# Altium project LLY.PrjPcb
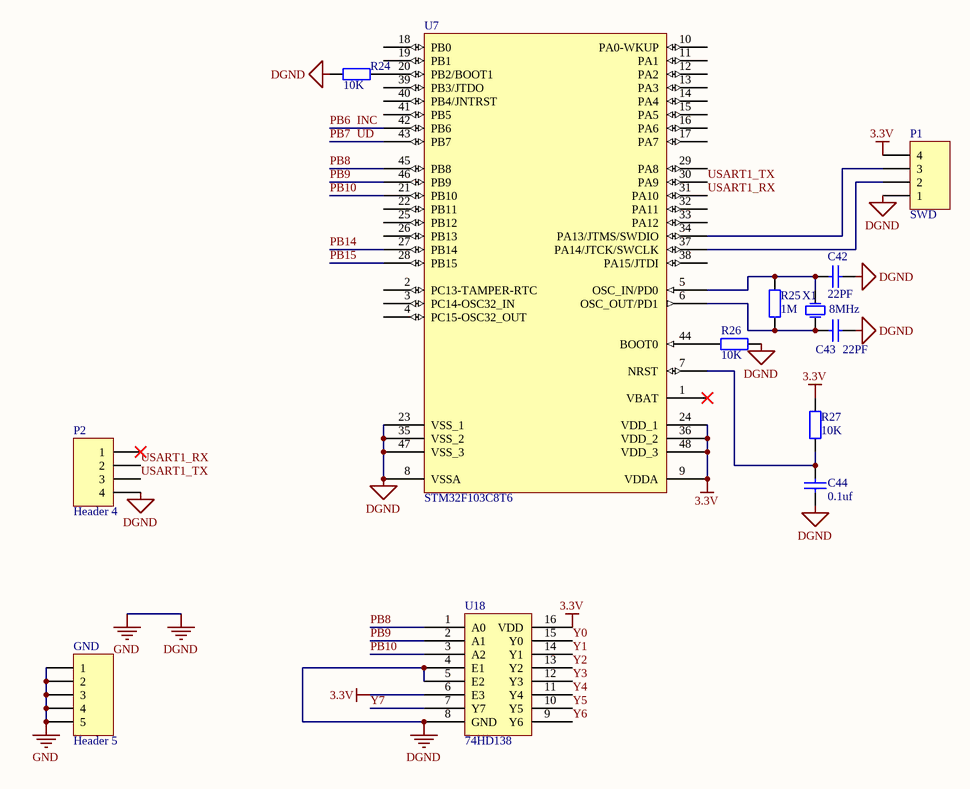
[diagram p0: LLY.SchDoc]
8 sheets, 280 parts. Net scope: global (net labels, ports and power ports of the same name join across sheets).
Board file: LLY.PcbDoc
Sheets:
  LLY.SchDoc
  POWER.SchDoc
  Audio_in.SchDoc
  Audio_out.SchDoc
  channel12.SchDoc
  channel78.SchDoc
  channel34.SchDoc
  channel56.SchDoc

## Sheet LLY.SchDoc
size A4

### Parts
C42  22PF  [0805C]
C43  22PF  [0805C]
C44  0.1uf  [0805C]
GND  Header 5  [HDR1X5]
P1  SWD  [HDR1X4]
P2  Header 4  [XH2.54W-4P]
R24  10K  [0805R]
R25  1M  [0805R]
R26  10K  [0805R]
R27  10K  [0805R]
U7  STM32F103C8T6  [LQFP48_L]
U18  74HD138  [SOP16]
X1  8MHz  [XTAL_US]

### Nets
3.3V: P1.4 R27.2 U7.9(VDDA) U7.24(VDD_1) U7.36(VDD_2) U7.48(VDD_3) U18.6(E3) U18.16(VDD)
DGND: C42.1 C43.1 C44.2 GND.1 GND.2 GND.3 GND.4 GND.5 P1.1 P2.4 R24.1 R26.2 U7.8(VSSA) U7.23(VSS_1) U7.35(VSS_2) U7.47(VSS_3) U18.4(E1) U18.5(E2) U18.8(GND)  [also labelled GND]
INC: U7.42(PB6)  [also labelled PB6]
PB7: U7.43(PB7)  [also labelled UD]
PB8: U7.45(PB8) U18.1(A0)
PB9: U7.46(PB9) U18.2(A1)
PB10: U7.21(PB10) U18.3(A2)
PB14: U7.27(PB14)
PB15: U7.28(PB15)
USART1_RX: P2.2 U7.31(PA10)
USART1_TX: P2.3 U7.30(PA9)
Y0: U18.15(Y0)
Y1: U18.14(Y1)
Y2: U18.13(Y2)
Y3: U18.12(Y3)
Y4: U18.11(Y4)
Y5: U18.10(Y5)
Y6: U18.9(Y6)
Y7: U18.7(Y7)
NetC42_2: C42.2 R25.1 U7.5(OSC_IN/PD0) X1.2(OSC2)
NetC43_2: C43.2 R25.2 U7.6(OSC_OUT/PD1) X1.1(OSC1)
NetC44_1: C44.1 R27.1 U7.7(NRST)
NetP1_2: P1.2 U7.37(PA14/JTCK/SWCLK)
NetP1_3: P1.3 U7.34(PA13/JTMS/SWDIO)
NetR24_2: R24.2 U7.20(PB2/BOOT1)
NetR26_1: R26.1 U7.44(BOOT0)

Not connected (* = marked no-connect by the designer): P2 1*; U7 1(VBAT)* 2(PC13-TAMPER-RTC) 3(PC14-OSC32_IN) 4(PC15-OSC32_OUT) 10(PA0-WKUP) 11(PA1) 12(PA2) 13(PA3) 14(PA4) 15(PA5) 16(PA6) 17(PA7) 18(PB0) 19(PB1) 22(PB11) 25(PB12) 26(PB13) 29(PA8) 32(PA11) 33(PA12) 38(PA15/JTDI) 39(PB3/JTDO) 40(PB4/JNTRST) 41(PB5)

### Library data of the parts
C42 C43 = Cap: Capacitor; Value: 0.1uF; Published: 8-Jun-2000; LatestRevisionDate: 17-Jul-2002; LatestRevisionNote: Re-released for DXP Platform.; PackageReference: RAD-0.3; Publisher: Altium Limited; PackageDescription: Radial Cap, Thru-Hole; 2 Leads; 0.3 in Pin Spacing
C44 = Cap: Capacitor; Value: 0.01uF; Published: 8-Jun-2000; LatestRevisionDate: 17-Jul-2002; LatestRevisionNote: Re-released for DXP Platform.; PackageReference: RAD-0.3; Publisher: Altium Limited; PackageDescription: Radial Cap, Thru-Hole; 2 Leads; 0.3 in Pin Spacing
GND = Header 5: Header, 5-Pin; LatestRevisionDate: 17-Jul-2002; LatestRevisionNote: Re-released for DXP Platform.; Publisher: Altium Limited
P1 = Header 4: LatestRevisionDate: 17-Jul-2002; LatestRevisionNote: Re-released for DXP Platform.; Publisher: Altium Limited
P2 = Header 4: Header, 4-Pin; LatestRevisionDate: 17-Jul-2002; LatestRevisionNote: Re-released for DXP Platform.; Publisher: Altium Limited
R24-R26 = Res2: Resistor; Published: 8-Jun-2000; LatestRevisionDate: 17-Jul-2002; LatestRevisionNote: Re-released for DXP Platform.; PackageReference: AXIAL-0.4; Publisher: Altium Limited; PackageDescription: Axial Device, Thru-Hole; 2 Leads; 0.4 in Pin Spacing
  R24 R26: Value: 10K
R27 = Res2: Resistor; Value: 1K; Published: 8-Jun-2000; LatestRevisionDate: 17-Jul-2002; LatestRevisionNote: Re-released for DXP Platform.; PackageReference: AXIAL-0.4; Publisher: Altium Limited; PackageDescription: Axial Device, Thru-Hole; 2 Leads; 0.4 in Pin Spacing
U7 = STM32F103CBT6: STM32单片机48脚; Published: 30-May-2008; DatasheetVersion: rev6, Mar-2008; PackageVersion: Mar-2008; PackageReference: LQFP48; Publisher: Altium Limited; PackageDescription: 48-Pin Low-Profile Quad Flat Pack, 7 x 7 mm Body, 0.5 mm Pitch (LQFP48); ComponentLink1Description: Manufacturer Link; ComponentLink1URL: www.st.com/stm32; ComponentLink2Description: Datasheet; ComponentLink2URL: http://www.st.com/stonline/products/literature/ds/13587.pdf
U18 = 74HD138: 74HC138
X1 = XTAL: Crystal Oscillator; Published: 8-Jun-2000; LatestRevisionDate: 17-Jul-2002; LatestRevisionNote: Re-released for DXP Platform.; Publisher: Altium Limited

## Sheet POWER.SchDoc
size A4
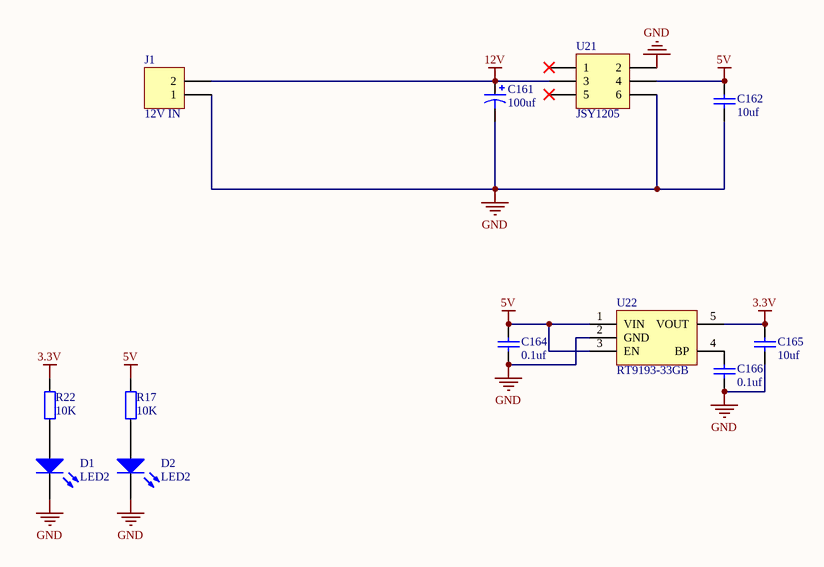
[diagram p1: POWER.SchDoc]

### Parts
C161  100uf  [7343C]
C162  10uf  [0805C]
C164  0.1uf  [0805C]
C165  10uf  [0805C]
C166  0.1uf  [0805C]
D1  LED2  [LED-0805]
D2  LED2  [LED-0805]
J1  12V IN  [VH3.96*2]
R17  10K  [0805R]
R22  10K  [0805R]
U21  JSY1205  [JSY_1205]
U22  RT9193-33GB  [SOT-23-5L]

### Nets
3.3V: C165.2 R22.2 U22.5(VOUT)
5V: C162.2 C164.2 R17.2 U21.4 U22.1(VIN) U22.3(EN)
12V: C161.1 J1.2 U21.3
GND: C161.2 C162.1 C164.1 C165.1 C166.1 D1.2(K) D2.2(K) J1.1 U21.2 U21.6 U22.2(GND)  [project net DGND]
NetC166_2: C166.2 U22.4(BP)
NetD1_1: D1.1(A) R22.1
NetD2_1: D2.1(A) R17.1

Not connected (* = marked no-connect by the designer): U21 1* 5*

### Library data of the parts
C161 = Cap Pol1: Polarized Capacitor (Radial); Published: 8-Jun-2000; LatestRevisionDate: 17-Jul-2002; LatestRevisionNote: Re-released for DXP Platform.; PackageReference: RB7.6-15; Publisher: Altium Limited; PackageDescription: Polarized Capacitor (Radial); 2 Leads
C162 C165 C166 = Cap: Capacitor; Published: 8-Jun-2000; LatestRevisionDate: 17-Jul-2002; LatestRevisionNote: Re-released for DXP Platform.; PackageReference: RAD-0.3; Publisher: Altium Limited; PackageDescription: Radial Cap, Thru-Hole; 2 Leads; 0.3 in Pin Spacing
C164 = Cap: capacitor; Published: 8-Jun-2000; LatestRevisionDate: 17-Jul-2002; LatestRevisionNote: Re-released for DXP Platform.; PackageReference: RAD-0.3; Publisher: Altium Limited; PackageDescription: Radial Cap, Thru-Hole; 2 Leads; 0.3 in Pin Spacing
D1 D2 = LED2: Typical RED, GREEN, YELLOW, AMBER GaAs LED; Published: 8-Jun-2000; LatestRevisionDate: 17-Jul-2002; LatestRevisionNote: Re-released for DXP Platform.; PackageVersion: Feb-2002; PackageReference: 3.2X1.6X1.1; Publisher: Altium Limited; PackageDescription: SM LED; 2 Flat Leads
J1 = Header 2: Header, 2-Pin; LatestRevisionDate: 17-Jul-2002; LatestRevisionNote: Re-released for DXP Platform.; Publisher: Altium Limited
R17 R22 = Res2: Resistor; Value: 1K; Published: 8-Jun-2000; LatestRevisionDate: 17-Jul-2002; LatestRevisionNote: Re-released for DXP Platform.; PackageReference: AXIAL-0.4; Publisher: Altium Limited; PackageDescription: Axial Device, Thru-Hole; 2 Leads; 0.4 in Pin Spacing
U21 = Header 3X2: Header, 3-Pin, Dual row; LatestRevisionDate: 17-Jul-2002; LatestRevisionNote: Re-released for DXP Platform.; Publisher: Altium Limited
U22 = RT9193: 电源芯片

## Sheet Audio_in.SchDoc
size A4
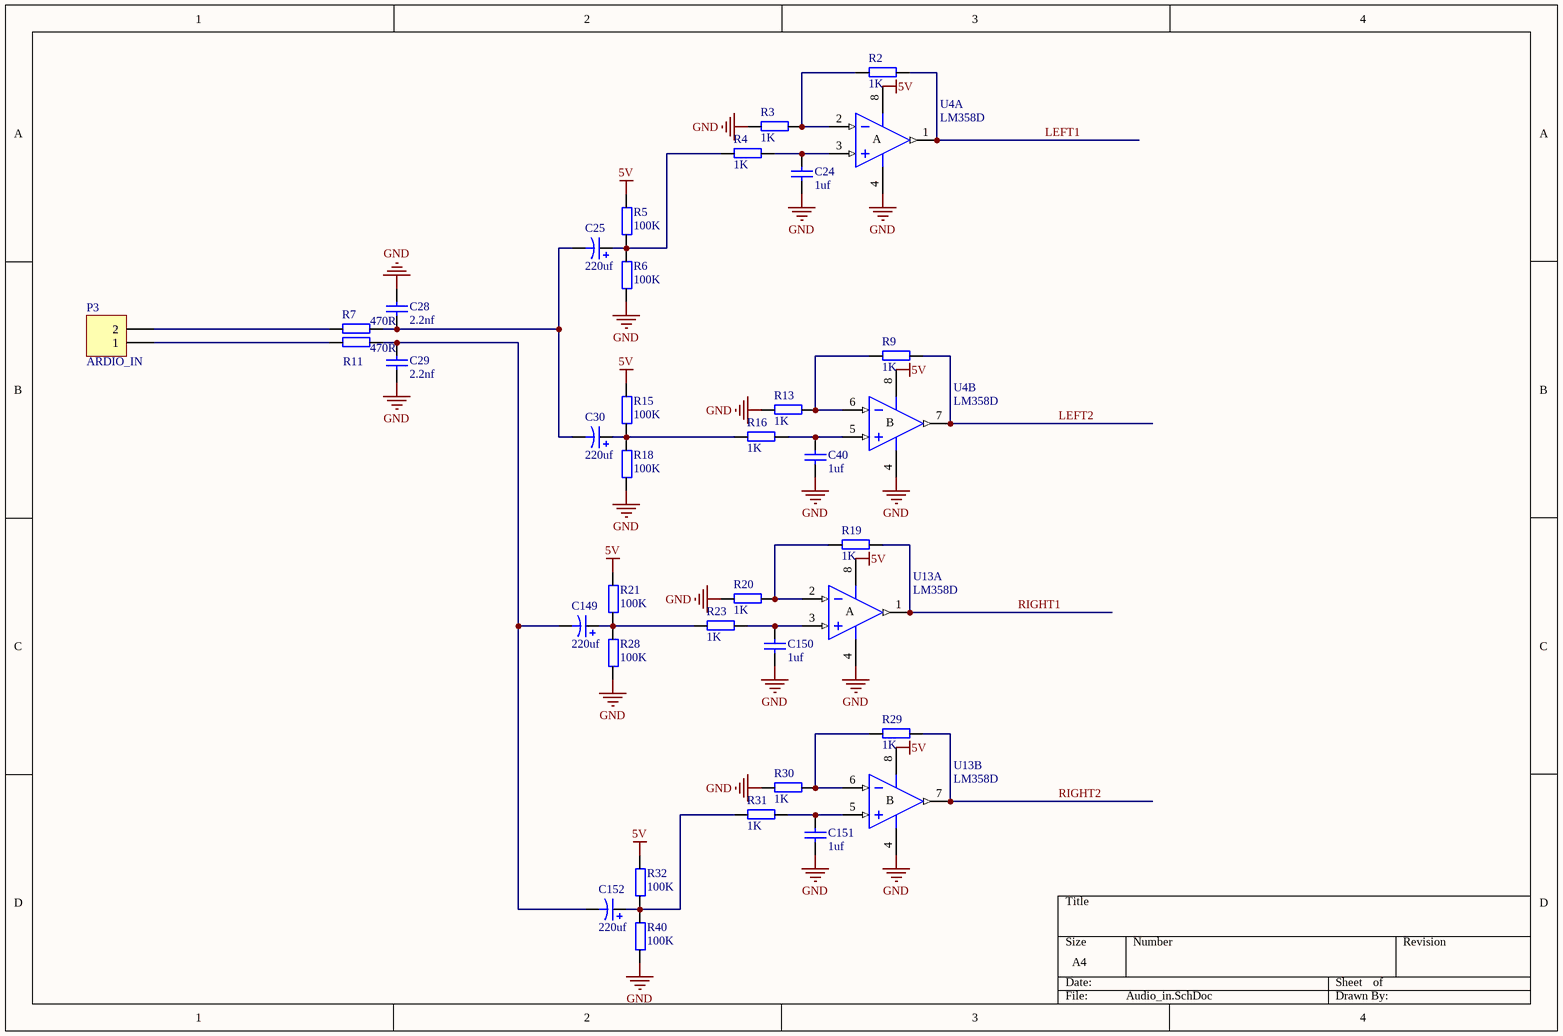
[diagram p2: Audio_in.SchDoc]

### Parts
C24  1uf  [0805C]
C25  220uf  [6032c]
C28  2.2nf  [0805C]
C29  2.2nf  [0805C]
C30  220uf  [6032c]
C40  1uf  [0805C]
C149  220uf  [6032c]
C150  1uf  [0805C]
C151  1uf  [0805C]
C152  220uf  [6032c]
P3  ARDIO_IN  [耳机座]
R2  1K  [0805R]
R3  1K  [0805R]
R4  1K  [0805R]
R5  100K  [0805R]
R6  100K  [0805R]
R7  470R  [0805R]
R9  1K  [0805R]
R11  470R  [0805R]
R13  1K  [0805R]
R15  100K  [0805R]
R16  1K  [0805R]
R18  100K  [0805R]
R19  1K  [0805R]
R20  1K  [0805R]
R21  100K  [0805R]
R23  1K  [0805R]
R28  100K  [0805R]
R29  1K  [0805R]
R30  1K  [0805R]
R31  1K  [0805R]
R32  100K  [0805R]
R40  100K  [0805R]
U4  LM358D  [D008_L]  (parts A,B of 2)
U13  LM358D  [D008_L]  (parts A,B of 2)

### Nets
5V: R5.2 R15.2 R21.2 R32.2 U4.8(V+) U13.8(V+)
GND: C24.2 C28.1 C29.2 C40.2 C150.2 C151.2 R3.2 R6.1 R13.2 R18.1 R20.2 R28.1 R30.2 R40.1 U4.4(V-) U13.4(V-)  [project net DGND]
LEFT1: R2.1 U4.1(OUT)
LEFT2: R9.1 U4.7(OUT)
RIGHT1: R19.1 U13.1(OUT)
RIGHT2: R29.1 U13.7(OUT)
NetC24_1: C24.1 R4.1 U4.3(IN+)
NetC25_1: C25.1 R4.2 R5.1 R6.2
NetC25_2: C25.2 C28.2 C30.2 R7.1
NetC29_1: C29.1 C149.2 C152.2 R11.1
NetC30_1: C30.1 R15.1 R16.2 R18.2
NetC40_1: C40.1 R16.1 U4.5(IN+)
NetC149_1: C149.1 R21.1 R23.2 R28.2
NetC150_1: C150.1 R23.1 U13.3(IN+)
NetC151_1: C151.1 R31.1 U13.5(IN+)
NetC152_1: C152.1 R31.2 R32.1 R40.2
NetP3_1: P3.1 R11.2
NetP3_2: P3.2 R7.2
NetR2_2: R2.2 R3.1 U4.2(IN-)
NetR9_2: R9.2 R13.1 U4.6(IN-)
NetR19_2: R19.2 R20.1 U13.2(IN-)
NetR29_2: R29.2 R30.1 U13.6(IN-)

### Notes on the sheet
- (in symbol LM358D, part A) A
- (in symbol LM358D, part B) B

### Library data of the parts
C24 C28 C29 C40 C150 C151 = Cap: Capacitor; Value: 0.1uF; Published: 8-Jun-2000; LatestRevisionDate: 17-Jul-2002; LatestRevisionNote: Re-released for DXP Platform.; PackageReference: RAD-0.3; Publisher: Altium Limited; PackageDescription: Radial Cap, Thru-Hole; 2 Leads; 0.3 in Pin Spacing
C25 C30 C149 C152 = Cap Pol1: Polarized Capacitor (Radial); Published: 8-Jun-2000; LatestRevisionDate: 17-Jul-2002; LatestRevisionNote: Re-released for DXP Platform.; PackageReference: RB7.6-15; Publisher: Altium Limited; PackageDescription: Polarized Capacitor (Radial); 2 Leads
P3 = Header 2: Header, 2-Pin; LatestRevisionDate: 17-Jul-2002; LatestRevisionNote: Re-released for DXP Platform.; Publisher: Altium Limited
R2-R7 R9 R11 R13 R15 R16 R18-R21 R23 R28-R32 R40 = R
U4 U13 = LM358D: Dual Operational Amplifier; Published: 16-Jan-2001; LatestRevisionDate: 13-Apr-2006; LatestRevisionNote: IPC-7351 Footprint Added.; DatasheetVersion: Jul-1998; PackageVersion: Jan-1998; PackageReference: D008; Publisher: Altium Limited; PackageDescription: 8-Pin Small Outline Integrated Circuit 1.27 mm Pitch; Code_IPC: SOIC127P600-8; ComponentLink1Description: Manufacturer Link; ComponentLink1URL: http://www.ti.com/; ComponentLink2Description: Datasheet; ComponentLink2URL: http://www-s.ti.com/sc/ds/lm358.pdf

## Sheet Audio_out.SchDoc
size A4
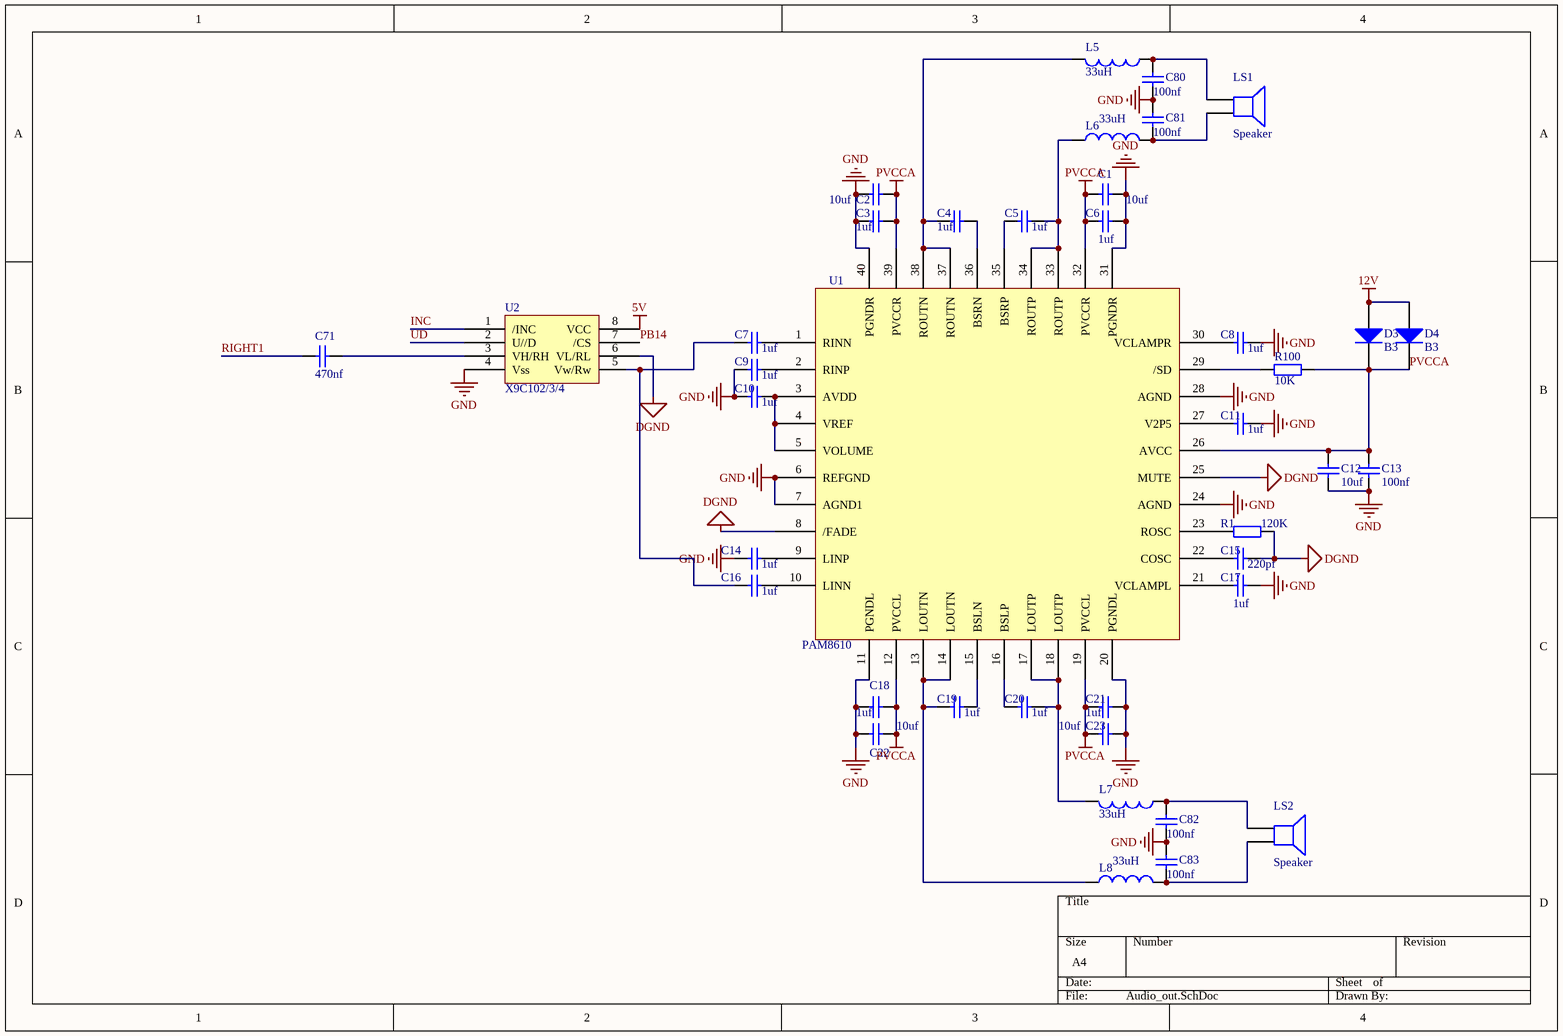
[diagram p3: Audio_out.SchDoc]

### Parts
C1  10uf  [0805C]
C2  10uf  [0805C]
C3  1uf  [0805C]
C4  1uf  [0805C]
C5  1uf  [0805C]
C6  1uf  [0805C]
C7  1uf  [0805C]
C8  1uf  [0805C]
C9  1uf  [0805C]
C10  1uf  [0805C]
C11  1uf  [0805C]
C12  10uf  [0805C]
C13  100nf  [0805C]
C14  1uf  [0805C]
C15  220pf  [0805C]
C16  1uf  [0805C]
C17  1uf  [0805C]
C18  1uf  [0805C]
C19  1uf  [0805C]
C20  1uf  [0805C]
C21  1uf  [0805C]
C22  10uf  [0805C]
C23  10uf  [0805C]
C71  470nf  [0805C]
C80  100nf  [0805C]
C81  100nf  [0805C]
C82  100nf  [0805C]
C83  100nf  [0805C]
D3  B3  [LL-34 - duplicate]
D4  B3  [LL-34 - duplicate]
L5  33uH  [L0805]
L6  33uH  [L0805]
L7  33uH  [L0805]
L8  33uH  [L0805]
LS1  Speaker  [PIN2]
LS2  Speaker  [PIN2]
R1  120K  [0805R]
R100  10K  [0805R]
U1  PAM8610  [QFN40-0.5]
U2  X9C102/3/4  [sop_8]

### Nets
5V: U2.8(VCC)
12V: D3.1(A) D4.1(A)
DGND: C1.2 C2.1 C3.1 C6.2 C8.1 C9.2 C10.2 C11.1 C12.2 C13.2 C14.2 C15.1 C17.2 C18.2 C21.1 C22.2 C23.1 C80.2 C81.1 C82.2 C83.1 R1.2 U1.6(REFGND) U1.7(AGND1) U1.8(/FADE) U1.11(PGNDL) U1.20(PGNDL) U1.24(AGND) U1.25(MUTE) U1.28(AGND) U1.31(PGNDR) U1.40(PGNDR) U2.4(Vss) U2.6(VL/RL)  [also labelled GND]
PVCCA: C1.1 C2.2 C3.2 C6.1 C12.1 C13.1 C18.1 C21.2 C22.1 C23.2 D3.2(K) D4.2(K) R100.1 U1.12(PVCCL) U1.19(PVCCL) U1.26(AVCC) U1.32(PVCCR) U1.39(PVCCR)
INC: U2.1(/INC)
PB14: U2.7(/CS)
RIGHT1: C71.2
UD: U2.2(U//D)  [project net PB7]
NetC4_1: C4.1 U1.36(BSRN)
NetC4_2: C4.2 L5.2 U1.37(ROUTN) U1.38(ROUTN)
NetC5_1: C5.1 L6.1 U1.33(ROUTP) U1.34(ROUTP)
NetC5_2: C5.2 U1.35(BSRP)
NetC7_1: C7.1 U1.1(RINN)
NetC7_2: C7.2 C16.2 U2.5(Vw/Rw)
NetC8_2: C8.2 U1.30(VCLAMPR)
NetC9_1: C9.1 U1.2(RINP)
NetC10_1: C10.1 U1.3(AVDD) U1.4(VREF) U1.5(VOLUME)
NetC11_2: C11.2 U1.27(V2P5)
NetC14_1: C14.1 U1.9(LINP)
NetC15_2: C15.2 U1.22(COSC)
NetC16_1: C16.1 U1.10(LINN)
NetC17_1: C17.1 U1.21(VCLAMPL)
NetC19_1: C19.1 U1.15(BSLN)
NetC19_2: C19.2 L8.1 U1.13(LOUTN) U1.14(LOUTN)
NetC20_1: C20.1 L7.2 U1.17(LOUTP) U1.18(LOUTP)
NetC20_2: C20.2 U1.16(BSLP)
NetC71_1: C71.1 U2.3(VH/RH)
NetC80_1: C80.1 L5.1 LS1.1
NetC81_2: C81.2 L6.2 LS1.2
NetC82_1: C82.1 L7.1 LS2.1
NetC83_2: C83.2 L8.2 LS2.2
NetR1_1: R1.1 U1.23(ROSC)
NetR100_2: R100.2 U1.29(/SD)

### Library data of the parts
C1-C23 C71 C80-C83 = Cap: Capacitor; Value: 0.1uF; Published: 8-Jun-2000; LatestRevisionDate: 17-Jul-2002; LatestRevisionNote: Re-released for DXP Platform.; PackageReference: RAD-0.3; Publisher: Altium Limited; PackageDescription: Radial Cap, Thru-Hole; 2 Leads; 0.3 in Pin Spacing
D3 D4 = Diode 1N4148: High Conductance Fast Diode; Published: 8-Jun-2000; LatestRevisionDate: 17-Jul-2002; LatestRevisionNote: Re-released for DXP Platform.; DatasheetVersion: 1997; PackageReference: DO-35; Publisher: Altium Limited; PackageDescription: Diode, Axial; Body 3.8 x 1.9 mm (LxDia. max), Lead Dia. 0.53 mm (max); Code_JEDEC: DO-204-AH; ComponentLink1Description: Manufacturer Link; ComponentLink1URL: http://www.fairchildsemi.com/; ComponentLink2Description: Datasheet; ComponentLink2URL: http://www.fairchildsemi.com/ds/1N%2F1N4148.pdf
L5-L8 = Inductor: Code_IEC: 1005; Published: 8-Jun-2000; LatestRevisionDate: 29-May-2009; LatestRevisionNote: IPC-7351 Footprint Added.; PackageReference: 0402-A; Publisher: Altium Limited; PackageDescription: Chip Inductor; Code_JEITA: 0402
LS1 LS2 = Speaker: Loudspeaker; Published: 24-Mar-1999; LatestRevisionDate: 17-Jul-2002; LatestRevisionNote: Re-released for DXP Platform.; PackageReference: PIN2; Publisher: Altium Limited
R1 = Res2: Resistor; Value: 10K; Published: 8-Jun-2000; LatestRevisionDate: 17-Jul-2002; LatestRevisionNote: Re-released for DXP Platform.; PackageReference: AXIAL-0.4; Publisher: Altium Limited; PackageDescription: Axial Device, Thru-Hole; 2 Leads; 0.4 in Pin Spacing
R100 = Res2: Resistor; Published: 8-Jun-2000; LatestRevisionDate: 17-Jul-2002; LatestRevisionNote: Re-released for DXP Platform.; PackageReference: AXIAL-0.4; Publisher: Altium Limited; PackageDescription: Axial Device, Thru-Hole; 2 Leads; 0.4 in Pin Spacing; Value: 10K

## Sheet channel12.SchDoc
size A4
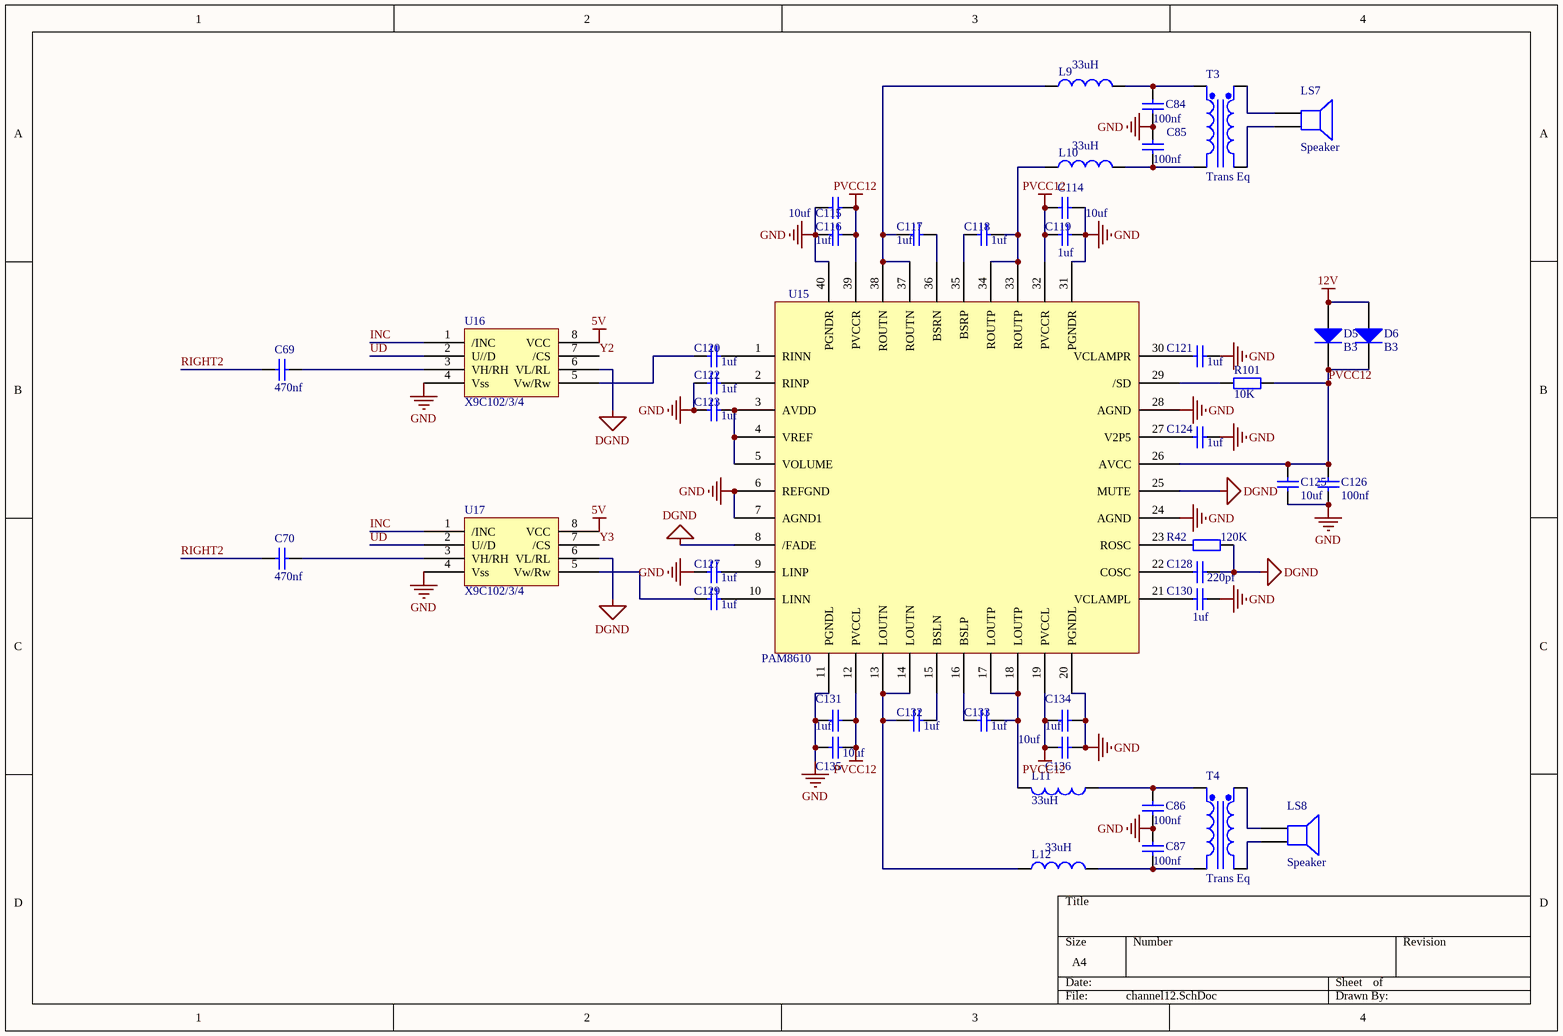
[diagram p4: channel12.SchDoc]

### Parts
(Parts that share a designator on the sheet are numbered #1, #2 ... from top to bottom, then left to right.)
C69  470nf  [0805C]
C70#1  470nf  [0805C]
C84  100nf  [0805C]
C85  100nf  [0805C]
C86  100nf  [0805C]
C87  100nf  [0805C]
C114  10uf  [0805C]
C115  10uf  [0805C]
C116  1uf  [0805C]
C117  1uf  [0805C]
C118  1uf  [0805C]
C119  1uf  [0805C]
C120  1uf  [0805C]
C121  1uf  [0805C]
C122  1uf  [0805C]
C123  1uf  [0805C]
C124  1uf  [0805C]
C125  10uf  [0805C]
C126  100nf  [0805C]
C127  1uf  [0805C]
C128  220pf  [0805C]
C129  1uf  [0805C]
C130  1uf  [0805C]
C131  1uf  [0805C]
C132  1uf  [0805C]
C133  1uf  [0805C]
C134  1uf  [0805C]
C135  10uf  [0805C]
C136  10uf  [0805C]
D5  B3  [LL-34 - duplicate]
D6  B3  [LL-34 - duplicate]
L9  33uH  [L0805]
L10  33uH  [L0805]
L11  33uH  [L0805]
L12  33uH  [L0805]
LS7  Speaker  [耳机座]
LS8  Speaker  [耳机座]
R42  120K  [0805R]
R101  10K  [0805R]
T3  Trans Eq  [Transistor]
T4  Trans Eq  [Transistor]
U15  PAM8610  [QFN40-0.5]
U16  X9C102/3/4  [sop_8]
U17  X9C102/3/4  [sop_8]

### Nets
5V: U16.8(VCC) U17.8(VCC)
12V: D5.1(A) D6.1(A)
DGND: C84.2 C85.1 C86.2 C87.1 C114.2 C115.1 C116.1 C119.2 C121.1 C122.2 C123.2 C124.1 C125.2 C126.2 C127.2 C128.1 C130.2 C131.2 C134.1 C135.2 C136.1 R42.2 U15.6(REFGND) U15.7(AGND1) U15.8(/FADE) U15.11(PGNDL) U15.20(PGNDL) U15.24(AGND) U15.25(MUTE) U15.28(AGND) U15.31(PGNDR) U15.40(PGNDR) U16.4(Vss) U16.6(VL/RL) U17.4(Vss) U17.6(VL/RL)  [also labelled GND]
PVCC12: C114.1 C115.2 C116.2 C119.1 C125.1 C126.1 C131.1 C134.2 C135.1 C136.2 D5.2(K) D6.2(K) R101.1 U15.12(PVCCL) U15.19(PVCCL) U15.26(AVCC) U15.32(PVCCR) U15.39(PVCCR)
INC: U16.1(/INC) U17.1(/INC)
RIGHT2: C69.2 C70#1.2
UD: U16.2(U//D) U17.2(U//D)  [project net PB7]
Y2: U16.7(/CS)
Y3: U17.7(/CS)
NetC69_1: C69.1 U16.3(VH/RH)
NetC70#1_1: C70#1.1 U17.3(VH/RH)
NetC84_1: C84.1 L9.2 T3.1(Pri+)
NetC85_2: C85.2 L10.2 T3.2(Pri-)
NetC86_1: C86.1 L11.1 T4.1(Pri+)
NetC87_2: C87.2 L12.2 T4.2(Pri-)
NetC117_1: C117.1 U15.36(BSRN)
NetC117_2: C117.2 L9.1 U15.37(ROUTN) U15.38(ROUTN)
NetC118_1: C118.1 L10.1 U15.33(ROUTP) U15.34(ROUTP)
NetC118_2: C118.2 U15.35(BSRP)
NetC120_1: C120.1 U15.1(RINN)
NetC120_2: C120.2 U16.5(Vw/Rw)
NetC121_2: C121.2 U15.30(VCLAMPR)
NetC122_1: C122.1 U15.2(RINP)
NetC123_1: C123.1 U15.3(AVDD) U15.4(VREF) U15.5(VOLUME)
NetC124_2: C124.2 U15.27(V2P5)
NetC127_1: C127.1 U15.9(LINP)
NetC128_2: C128.2 U15.22(COSC)
NetC129_1: C129.1 U15.10(LINN)
NetC129_2: C129.2 U17.5(Vw/Rw)
NetC130_1: C130.1 U15.21(VCLAMPL)
NetC132_1: C132.1 U15.15(BSLN)
NetC132_2: C132.2 L12.1 U15.13(LOUTN) U15.14(LOUTN)
NetC133_1: C133.1 L11.2 U15.17(LOUTP) U15.18(LOUTP)
NetC133_2: C133.2 U15.16(BSLP)
NetLS7_1: LS7.1 T3.3(Sec+)
NetLS7_2: LS7.2 T3.4(Sec-)
NetLS8_1: LS8.1 T4.3(Sec+)
NetLS8_2: LS8.2 T4.4(Sec-)
NetR42_1: R42.1 U15.23(ROSC)
NetR101_2: R101.2 U15.29(/SD)

### Library data of the parts
C69 C70#1 C84-C87 C114-C136 = Cap: Capacitor; Value: 0.1uF; Published: 8-Jun-2000; LatestRevisionDate: 17-Jul-2002; LatestRevisionNote: Re-released for DXP Platform.; PackageReference: RAD-0.3; Publisher: Altium Limited; PackageDescription: Radial Cap, Thru-Hole; 2 Leads; 0.3 in Pin Spacing
D5 D6 = Diode 1N4148: High Conductance Fast Diode; Published: 8-Jun-2000; LatestRevisionDate: 17-Jul-2002; LatestRevisionNote: Re-released for DXP Platform.; DatasheetVersion: 1997; PackageReference: DO-35; Publisher: Altium Limited; PackageDescription: Diode, Axial; Body 3.8 x 1.9 mm (LxDia. max), Lead Dia. 0.53 mm (max); Code_JEDEC: DO-204-AH; ComponentLink1Description: Manufacturer Link; ComponentLink1URL: http://www.fairchildsemi.com/; ComponentLink2Description: Datasheet; ComponentLink2URL: http://www.fairchildsemi.com/ds/1N%2F1N4148.pdf
L9-L12 = Inductor: Code_IEC: 1005; Published: 8-Jun-2000; LatestRevisionDate: 29-May-2009; LatestRevisionNote: IPC-7351 Footprint Added.; PackageReference: 0402-A; Publisher: Altium Limited; PackageDescription: Chip Inductor; Code_JEITA: 0402
LS7 LS8 = Speaker: Loudspeaker; Published: 24-Mar-1999; LatestRevisionDate: 17-Jul-2002; LatestRevisionNote: Re-released for DXP Platform.; PackageReference: PIN2; Publisher: Altium Limited
R42 = Res2: Resistor; Value: 10K; Published: 8-Jun-2000; LatestRevisionDate: 17-Jul-2002; LatestRevisionNote: Re-released for DXP Platform.; PackageReference: AXIAL-0.4; Publisher: Altium Limited; PackageDescription: Axial Device, Thru-Hole; 2 Leads; 0.4 in Pin Spacing
R101 = Res2: Resistor; Published: 8-Jun-2000; LatestRevisionDate: 17-Jul-2002; LatestRevisionNote: Re-released for DXP Platform.; PackageReference: AXIAL-0.4; Publisher: Altium Limited; PackageDescription: Axial Device, Thru-Hole; 2 Leads; 0.4 in Pin Spacing; Value: 10K
T3 T4 = Trans Eq: Transformer (Equivalent Circuit Model); Published: 8-Jun-2000; LatestRevisionDate: 17-Jul-2002; LatestRevisionNote: Re-released for DXP Platform.; PackageReference: TRF_4; Publisher: Altium Limited; PackageDescription: Transformer; 4 Leads

## Sheet channel78.SchDoc
size A4
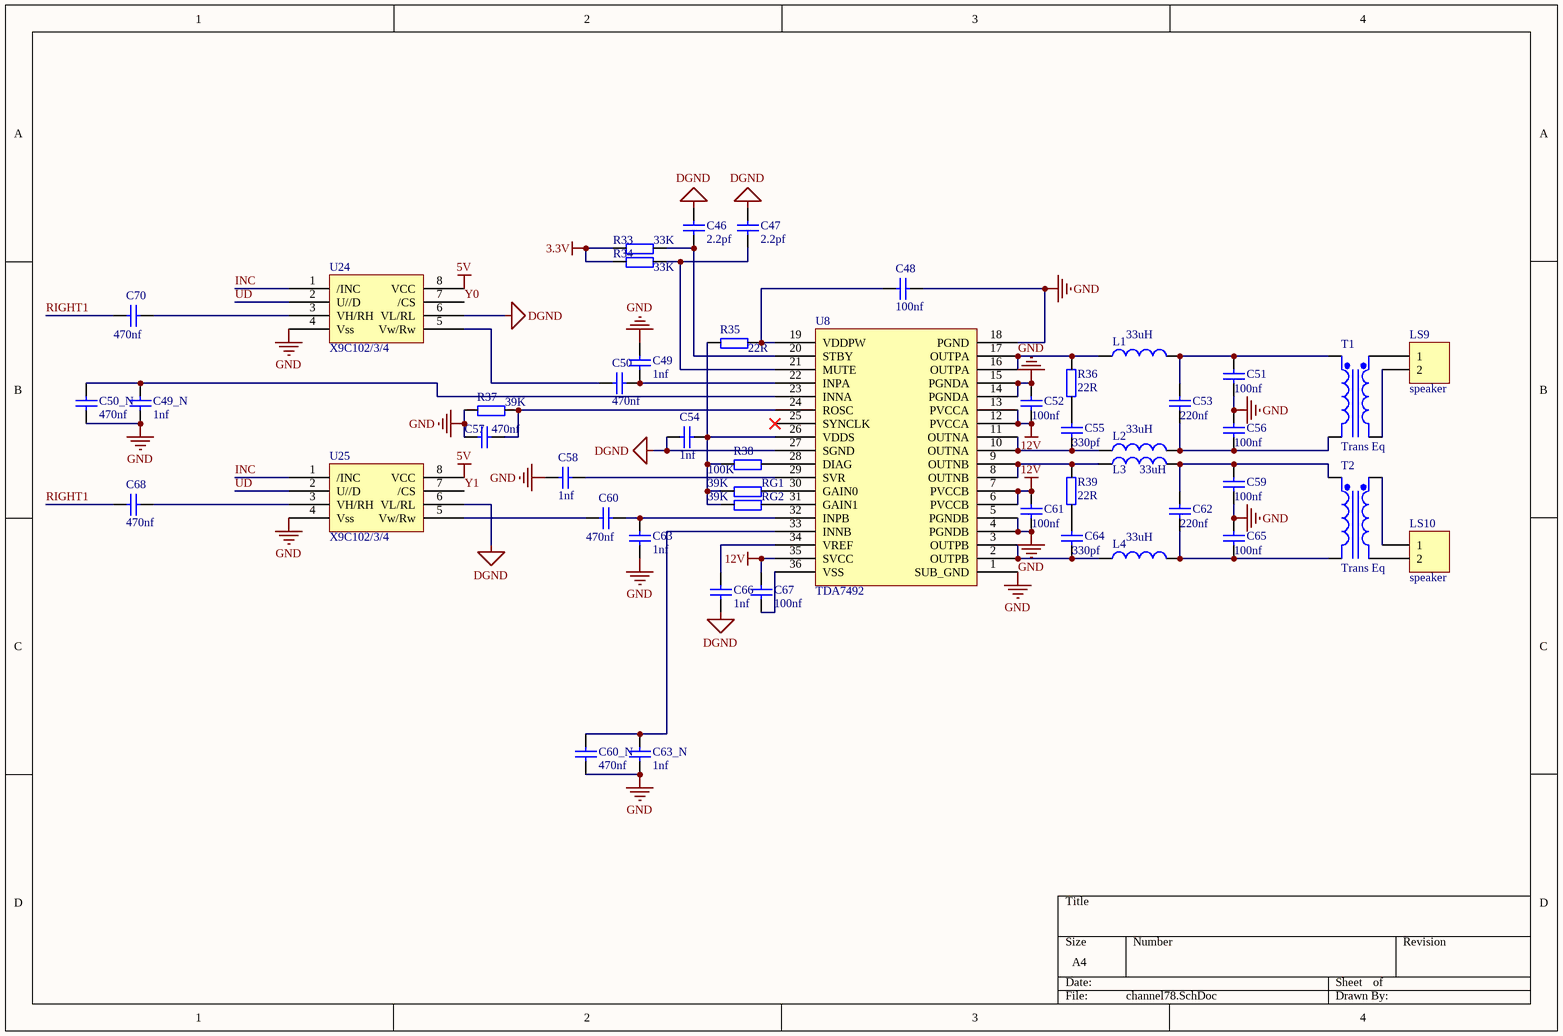
[diagram p5: channel78.SchDoc]

### Parts
(Parts that share a designator on the sheet are numbered #1, #2 ... from top to bottom, then left to right.)
C46  2.2pf  [0805C]
C47  2.2pf  [0805C]
C48  100nf  [0805C]
C49  1nf  [0805C]
C49_N  1nf  [0805C]
C50  470nf  [0805C]
C50_N  470nf  [0805C]
C51  100nf  [0805C]
C52  100nf  [0805C]
C53  220nf  [0805C]
C54  1nf  [0805C]
C55  330pf  [0805C]
C56  100nf  [0805C]
C57  470nf  [0805C]
C58  1nf  [0805C]
C59  100nf  [0805C]
C60  470nf  [0805C]
C60_N  470nf  [0805C]
C61  100nf  [0805C]
C62  220nf  [0805C]
C63  1nf  [0805C]
C63_N  1nf  [0805C]
C64  330pf  [0805C]
C65  100nf  [0805C]
C66  1nf  [0805C]
C67  100nf  [0805C]
C68  470nf  [0805C]
C70#2  470nf  [0805C]
L1  33uH  [L-7X7S]
L2  33uH  [L-7X7S]
L3  33uH  [L-7X7S]
L4  33uH  [L-7X7S]
LS9  speaker  [耳机座]
LS10  speaker  [耳机座]
R33  33K  [0805R]
R34  33K  [0805R]
R35  22R  [0805R]
R36  22R  [0805R]
R37  39K  [0805R]
R38  100K  [0805R]
R39  22R  [0805R]
RG1  39K  [0805R]
RG2  39K  [0805R]
T1  Trans Eq  [Transistor]
T2  Trans Eq  [Transistor]
U8  TDA7492  [POWERSSO-36]
U24  X9C102/3/4  [sop_8]
U25  X9C102/3/4  [sop_8]

### Nets
3.3V: R33.1 R34.1
5V: U24.8(VCC) U25.8(VCC)
12V: C52.2 C61.1 C67.2 U8.6(PVCCB) U8.7(PVCCB) U8.12(PVCCA) U8.13(PVCCA) U8.35(SVCC)
DGND: C46.2 C47.1 C48.1 C49.2 C49_N.1 C50_N.1 C51.2 C52.1 C54.2 C56.1 C57.1 C58.2 C59.2 C60_N.1 C61.2 C63.2 C63_N.2 C65.1 C66.2 R37.1 U8.1(SUB_GND) U8.4(PGNDB) U8.5(PGNDB) U8.14(PGNDA) U8.15(PGNDA) U8.18(PGND) U8.27(SGND) U24.4(Vss) U24.6(VL/RL) U25.4(Vss) U25.6(VL/RL)  [also labelled GND]
INC: U24.1(/INC) U25.1(/INC)
RIGHT1: C68.2 C70#2.1
UD: U24.2(U//D) U25.2(U//D)  [project net PB7]
Y0: U24.7(/CS)
Y1: U25.7(/CS)
NetC46_1: C46.1 R33.2 U8.20(STBY)
NetC47_2: C47.2 R34.2 U8.21(MUTE)
NetC48_2: C48.2 R35.2 U8.19(VDDPW)
NetC49_1: C49.1 C50.2 U8.22(INPA)
NetC49_N_2: C49_N.2 C50_N.2 U8.23(INNA)
NetC50_1: C50.1 U24.5(Vw/Rw)
NetC51_1: C51.1 C53.1 L1.2 T1.1(Pri+)
NetC53_2: C53.2 C56.2 L2.2 T1.2(Pri-)
NetC54_1: C54.1 R35.1 R38.1 RG1.1 RG2.1 U8.26(VDDS)
NetC55_1: C55.1 R36.2
NetC55_2: C55.2 L2.1 U8.10(OUTNA) U8.11(OUTNA)
NetC57_2: C57.2 R37.2 U8.24(ROSC)
NetC58_1: C58.1 U8.29(SVR)
NetC59_1: C59.1 C62.1 L3.2 T2.1(Pri+)
NetC60_1: C60.1 U25.5(Vw/Rw)
NetC60_2: C60.2 C63.1 U8.32(INPB)
NetC60_N_2: C60_N.2 C63_N.1 U8.33(INNB)
NetC62_2: C62.2 C65.2 L4.2 T2.2(Pri-)
NetC64_1: C64.1 R39.2
NetC64_2: C64.2 L4.1 U8.2(OUTPB) U8.3(OUTPB)
NetC66_1: C66.1 U8.34(VREF)
NetC67_1: C67.1 U8.36(VSS)
NetC68_1: C68.1 U25.3(VH/RH)
NetC70#2_2: C70#2.2 U24.3(VH/RH)
NetL1_1: L1.1 R36.1 U8.16(OUTPA) U8.17(OUTPA)
NetL3_1: L3.1 R39.1 U8.8(OUTNB) U8.9(OUTNB)
NetLS9_1: LS9.1 T1.3(Sec+)
NetLS9_2: LS9.2 T1.4(Sec-)
NetLS10_1: LS10.1 T2.3(Sec+)
NetLS10_2: LS10.2 T2.4(Sec-)
NetR38_2: R38.2 U8.28(DIAG)
NetRG1_2: RG1.2 U8.30(GAIN0)
NetRG2_2: RG2.2 U8.31(GAIN1)

Not connected (* = marked no-connect by the designer): U8 25(SYNCLK)*

### Library data of the parts
C46-C49 C49_N C50 C50_N C51-C60 C60_N C61-C63 C63_N C64-C68 C70#2 = Cap: Capacitor; Value: 0.1uF; Published: 8-Jun-2000; LatestRevisionDate: 17-Jul-2002; LatestRevisionNote: Re-released for DXP Platform.; PackageReference: RAD-0.3; Publisher: Altium Limited; PackageDescription: Radial Cap, Thru-Hole; 2 Leads; 0.3 in Pin Spacing
L1-L4 = Inductor: Code_IEC: 1005; Published: 8-Jun-2000; LatestRevisionDate: 29-May-2009; LatestRevisionNote: IPC-7351 Footprint Added.; PackageReference: 0402-A; Publisher: Altium Limited; PackageDescription: Chip Inductor; Code_JEITA: 0402
LS9 LS10 = Header 2: Header, 2-Pin; LatestRevisionDate: 17-Jul-2002; LatestRevisionNote: Re-released for DXP Platform.; Publisher: Altium Limited
R33-R39 RG1 RG2 = R
T1 T2 = Trans Eq: Transformer (Equivalent Circuit Model); Published: 8-Jun-2000; LatestRevisionDate: 17-Jul-2002; LatestRevisionNote: Re-released for DXP Platform.; PackageReference: TRF_4; Publisher: Altium Limited; PackageDescription: Transformer; 4 Leads

## Sheet channel34.SchDoc
size A4
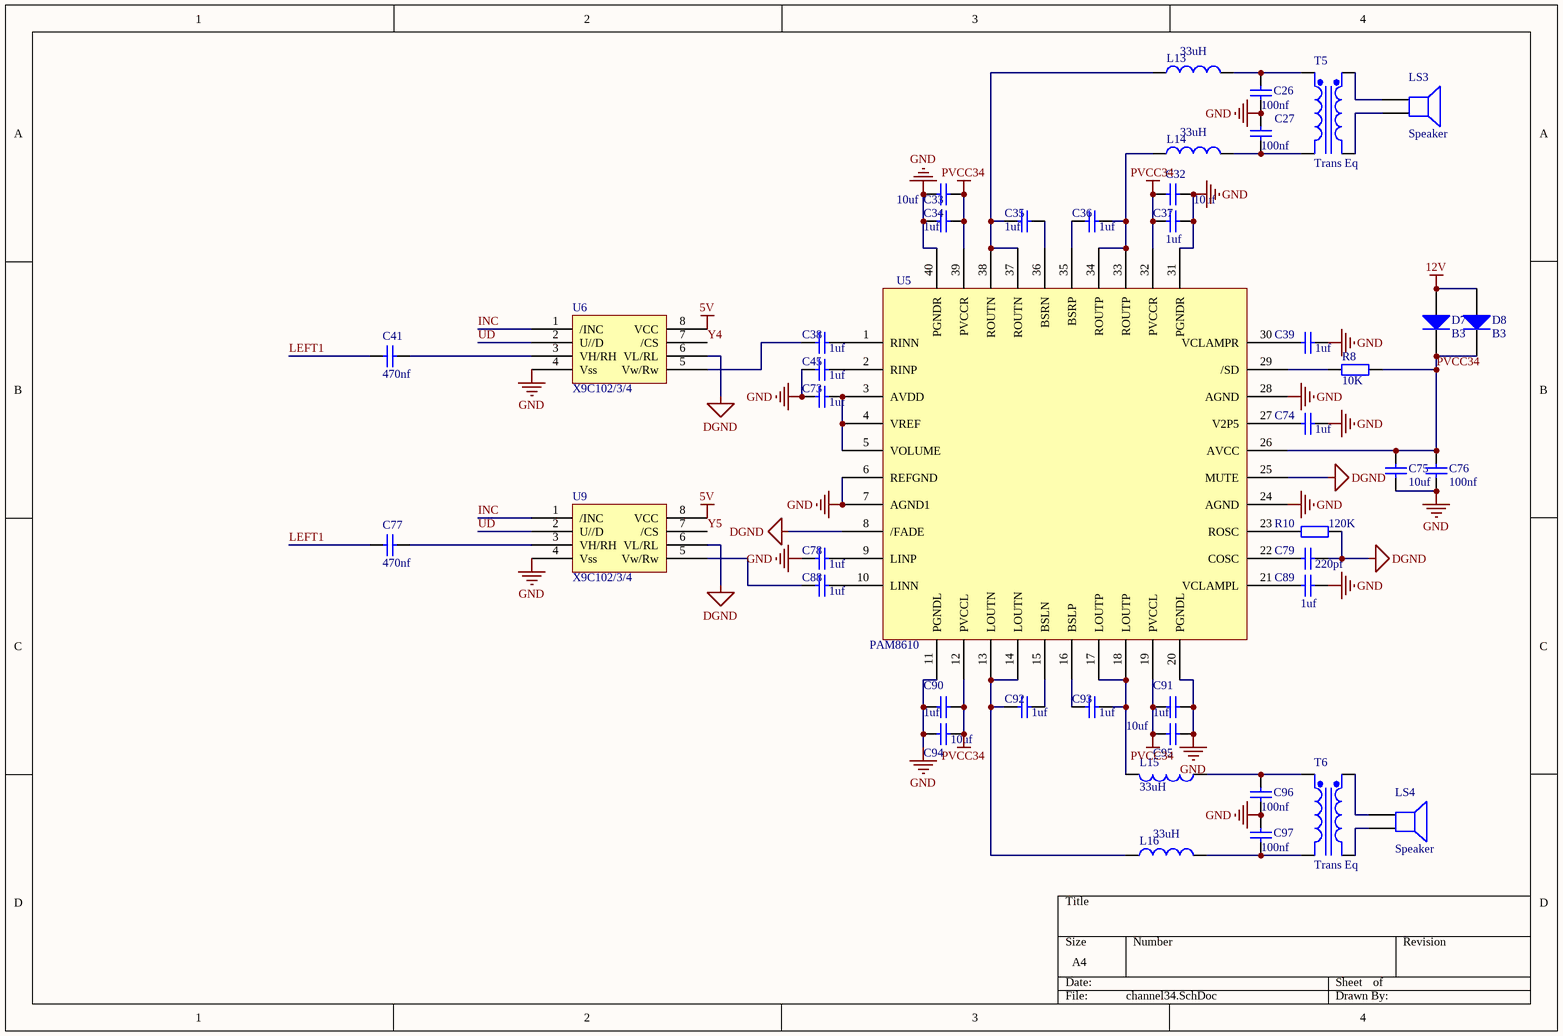
[diagram p6: channel34.SchDoc]

### Parts
C26  100nf  [0805C]
C27  100nf  [0805C]
C32  10uf  [0805C]
C33  10uf  [0805C]
C34  1uf  [0805C]
C35  1uf  [0805C]
C36  1uf  [0805C]
C37  1uf  [0805C]
C38  1uf  [0805C]
C39  1uf  [0805C]
C41  470nf  [0805C]
C45  1uf  [0805C]
C73  1uf  [0805C]
C74  1uf  [0805C]
C75  10uf  [0805C]
C76  100nf  [0805C]
C77  470nf  [0805C]
C78  1uf  [0805C]
C79  220pf  [0805C]
C88  1uf  [0805C]
C89  1uf  [0805C]
C90  1uf  [0805C]
C91  1uf  [0805C]
C92  1uf  [0805C]
C93  1uf  [0805C]
C94  10uf  [0805C]
C95  10uf  [0805C]
C96  100nf  [0805C]
C97  100nf  [0805C]
D7  B3  [LL-34 - duplicate]
D8  B3  [LL-34 - duplicate]
L13  33uH  [L0805]
L14  33uH  [L0805]
L15  33uH  [L0805]
L16  33uH  [L0805]
LS3  Speaker  [耳机座]
LS4  Speaker  [耳机座]
R8  10K  [0805R]
R10  120K  [0805R]
T5  Trans Eq  [Transistor]
T6  Trans Eq  [Transistor]
U5  PAM8610  [QFN40-0.5]
U6  X9C102/3/4  [sop_8]
U9  X9C102/3/4  [sop_8]

### Nets
5V: U6.8(VCC) U9.8(VCC)
12V: D7.1(A) D8.1(A)
DGND: C26.2 C27.1 C32.2 C33.1 C34.1 C37.2 C39.1 C45.2 C73.2 C74.1 C75.2 C76.2 C78.2 C79.1 C89.2 C90.2 C91.1 C94.2 C95.1 C96.2 C97.1 R10.2 U5.6(REFGND) U5.7(AGND1) U5.8(/FADE) U5.11(PGNDL) U5.20(PGNDL) U5.24(AGND) U5.25(MUTE) U5.28(AGND) U5.31(PGNDR) U5.40(PGNDR) U6.4(Vss) U6.6(VL/RL) U9.4(Vss) U9.6(VL/RL)  [also labelled GND]
PVCC34: C32.1 C33.2 C34.2 C37.1 C75.1 C76.1 C90.1 C91.2 C94.1 C95.2 D7.2(K) D8.2(K) R8.1 U5.12(PVCCL) U5.19(PVCCL) U5.26(AVCC) U5.32(PVCCR) U5.39(PVCCR)
INC: U6.1(/INC) U9.1(/INC)
LEFT1: C41.2 C77.2
UD: U6.2(U//D) U9.2(U//D)  [project net PB7]
Y4: U6.7(/CS)
Y5: U9.7(/CS)
NetC26_1: C26.1 L13.2 T5.1(Pri+)
NetC27_2: C27.2 L14.2 T5.2(Pri-)
NetC35_1: C35.1 U5.36(BSRN)
NetC35_2: C35.2 L13.1 U5.37(ROUTN) U5.38(ROUTN)
NetC36_1: C36.1 L14.1 U5.33(ROUTP) U5.34(ROUTP)
NetC36_2: C36.2 U5.35(BSRP)
NetC38_1: C38.1 U5.1(RINN)
NetC38_2: C38.2 U6.5(Vw/Rw)
NetC39_2: C39.2 U5.30(VCLAMPR)
NetC41_1: C41.1 U6.3(VH/RH)
NetC45_1: C45.1 U5.2(RINP)
NetC73_1: C73.1 U5.3(AVDD) U5.4(VREF) U5.5(VOLUME)
NetC74_2: C74.2 U5.27(V2P5)
NetC77_1: C77.1 U9.3(VH/RH)
NetC78_1: C78.1 U5.9(LINP)
NetC79_2: C79.2 U5.22(COSC)
NetC88_1: C88.1 U5.10(LINN)
NetC88_2: C88.2 U9.5(Vw/Rw)
NetC89_1: C89.1 U5.21(VCLAMPL)
NetC92_1: C92.1 U5.15(BSLN)
NetC92_2: C92.2 L16.1 U5.13(LOUTN) U5.14(LOUTN)
NetC93_1: C93.1 L15.2 U5.17(LOUTP) U5.18(LOUTP)
NetC93_2: C93.2 U5.16(BSLP)
NetC96_1: C96.1 L15.1 T6.1(Pri+)
NetC97_2: C97.2 L16.2 T6.2(Pri-)
NetLS3_1: LS3.1 T5.3(Sec+)
NetLS3_2: LS3.2 T5.4(Sec-)
NetLS4_1: LS4.1 T6.3(Sec+)
NetLS4_2: LS4.2 T6.4(Sec-)
NetR8_2: R8.2 U5.29(/SD)
NetR10_1: R10.1 U5.23(ROSC)

### Library data of the parts
C26 C27 C32-C39 C41 C45 C73-C79 C88-C97 = Cap: Capacitor; Value: 0.1uF; Published: 8-Jun-2000; LatestRevisionDate: 17-Jul-2002; LatestRevisionNote: Re-released for DXP Platform.; PackageReference: RAD-0.3; Publisher: Altium Limited; PackageDescription: Radial Cap, Thru-Hole; 2 Leads; 0.3 in Pin Spacing
D7 D8 = Diode 1N4148: High Conductance Fast Diode; Published: 8-Jun-2000; LatestRevisionDate: 17-Jul-2002; LatestRevisionNote: Re-released for DXP Platform.; DatasheetVersion: 1997; PackageReference: DO-35; Publisher: Altium Limited; PackageDescription: Diode, Axial; Body 3.8 x 1.9 mm (LxDia. max), Lead Dia. 0.53 mm (max); Code_JEDEC: DO-204-AH; ComponentLink1Description: Manufacturer Link; ComponentLink1URL: http://www.fairchildsemi.com/; ComponentLink2Description: Datasheet; ComponentLink2URL: http://www.fairchildsemi.com/ds/1N%2F1N4148.pdf
L13-L16 = Inductor: Code_IEC: 1005; Published: 8-Jun-2000; LatestRevisionDate: 29-May-2009; LatestRevisionNote: IPC-7351 Footprint Added.; PackageReference: 0402-A; Publisher: Altium Limited; PackageDescription: Chip Inductor; Code_JEITA: 0402
LS3 LS4 = Speaker: Loudspeaker; Published: 24-Mar-1999; LatestRevisionDate: 17-Jul-2002; LatestRevisionNote: Re-released for DXP Platform.; PackageReference: PIN2; Publisher: Altium Limited
R8 = Res2: Resistor; Published: 8-Jun-2000; LatestRevisionDate: 17-Jul-2002; LatestRevisionNote: Re-released for DXP Platform.; PackageReference: AXIAL-0.4; Publisher: Altium Limited; PackageDescription: Axial Device, Thru-Hole; 2 Leads; 0.4 in Pin Spacing; Value: 10K
R10 = Res2: Resistor; Value: 10K; Published: 8-Jun-2000; LatestRevisionDate: 17-Jul-2002; LatestRevisionNote: Re-released for DXP Platform.; PackageReference: AXIAL-0.4; Publisher: Altium Limited; PackageDescription: Axial Device, Thru-Hole; 2 Leads; 0.4 in Pin Spacing
T5 T6 = Trans Eq: Transformer (Equivalent Circuit Model); Published: 8-Jun-2000; LatestRevisionDate: 17-Jul-2002; LatestRevisionNote: Re-released for DXP Platform.; PackageReference: TRF_4; Publisher: Altium Limited; PackageDescription: Transformer; 4 Leads

## Sheet channel56.SchDoc
size A4
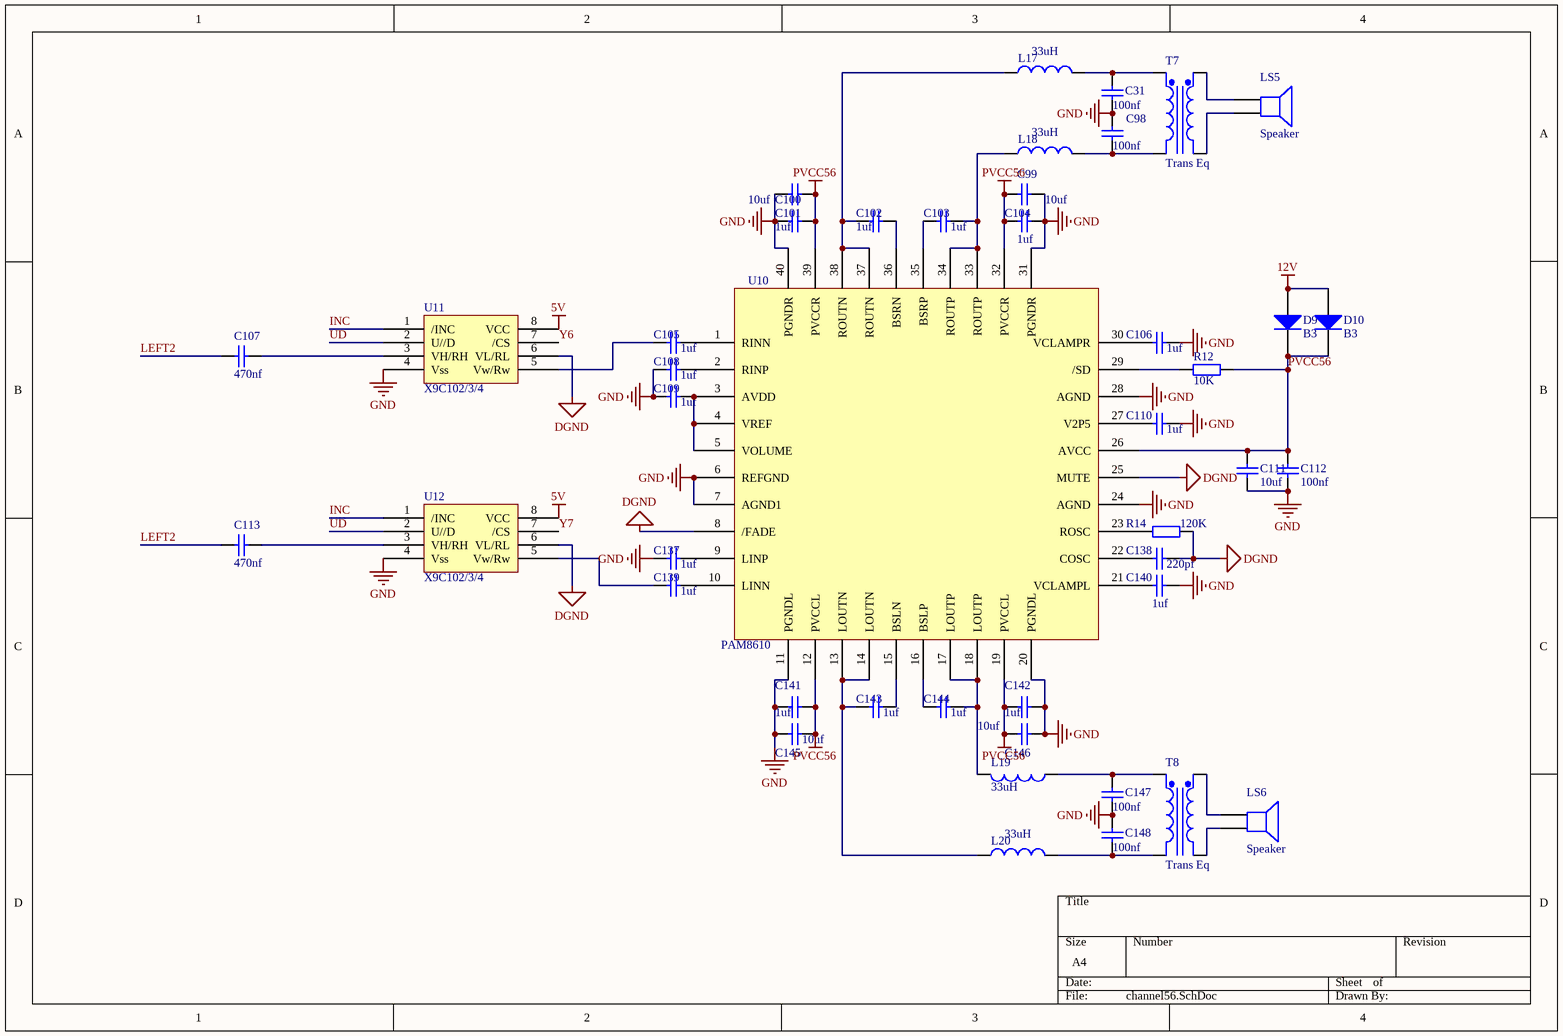
[diagram p7: channel56.SchDoc]

### Parts
C31  100nf  [0805C]
C98  100nf  [0805C]
C99  10uf  [0805C]
C100  10uf  [0805C]
C101  1uf  [0805C]
C102  1uf  [0805C]
C103  1uf  [0805C]
C104  1uf  [0805C]
C105  1uf  [0805C]
C106  1uf  [0805C]
C107  470nf  [0805C]
C108  1uf  [0805C]
C109  1uf  [0805C]
C110  1uf  [0805C]
C111  10uf  [0805C]
C112  100nf  [0805C]
C113  470nf  [0805C]
C137  1uf  [0805C]
C138  220pf  [0805C]
C139  1uf  [0805C]
C140  1uf  [0805C]
C141  1uf  [0805C]
C142  1uf  [0805C]
C143  1uf  [0805C]
C144  1uf  [0805C]
C145  10uf  [0805C]
C146  10uf  [0805C]
C147  100nf  [0805C]
C148  100nf  [0805C]
D9  B3  [LL-34 - duplicate]
D10  B3  [LL-34 - duplicate]
L17  33uH  [L0805]
L18  33uH  [L0805]
L19  33uH  [L0805]
L20  33uH  [L0805]
LS5  Speaker  [耳机座]
LS6  Speaker  [耳机座]
R12  10K  [0805R]
R14  120K  [0805R]
T7  Trans Eq  [Transistor]
T8  Trans Eq  [Transistor]
U10  PAM8610  [QFN40-0.5]
U11  X9C102/3/4  [sop_8]
U12  X9C102/3/4  [sop_8]

### Nets
5V: U11.8(VCC) U12.8(VCC)
12V: D9.1(A) D10.1(A)
DGND: C31.2 C98.1 C99.2 C100.1 C101.1 C104.2 C106.1 C108.2 C109.2 C110.1 C111.2 C112.2 C137.2 C138.1 C140.2 C141.2 C142.1 C145.2 C146.1 C147.2 C148.1 R14.2 U10.6(REFGND) U10.7(AGND1) U10.8(/FADE) U10.11(PGNDL) U10.20(PGNDL) U10.24(AGND) U10.25(MUTE) U10.28(AGND) U10.31(PGNDR) U10.40(PGNDR) U11.4(Vss) U11.6(VL/RL) U12.4(Vss) U12.6(VL/RL)  [also labelled GND]
PVCC56: C99.1 C100.2 C101.2 C104.1 C111.1 C112.1 C141.1 C142.2 C145.1 C146.2 D9.2(K) D10.2(K) R12.1 U10.12(PVCCL) U10.19(PVCCL) U10.26(AVCC) U10.32(PVCCR) U10.39(PVCCR)
INC: U11.1(/INC) U12.1(/INC)
LEFT2: C107.2 C113.2
UD: U11.2(U//D) U12.2(U//D)  [project net PB7]
Y6: U11.7(/CS)
Y7: U12.7(/CS)
NetC31_1: C31.1 L17.2 T7.1(Pri+)
NetC98_2: C98.2 L18.2 T7.2(Pri-)
NetC102_1: C102.1 U10.36(BSRN)
NetC102_2: C102.2 L17.1 U10.37(ROUTN) U10.38(ROUTN)
NetC103_1: C103.1 L18.1 U10.33(ROUTP) U10.34(ROUTP)
NetC103_2: C103.2 U10.35(BSRP)
NetC105_1: C105.1 U10.1(RINN)
NetC105_2: C105.2 U11.5(Vw/Rw)
NetC106_2: C106.2 U10.30(VCLAMPR)
NetC107_1: C107.1 U11.3(VH/RH)
NetC108_1: C108.1 U10.2(RINP)
NetC109_1: C109.1 U10.3(AVDD) U10.4(VREF) U10.5(VOLUME)
NetC110_2: C110.2 U10.27(V2P5)
NetC113_1: C113.1 U12.3(VH/RH)
NetC137_1: C137.1 U10.9(LINP)
NetC138_2: C138.2 U10.22(COSC)
NetC139_1: C139.1 U10.10(LINN)
NetC139_2: C139.2 U12.5(Vw/Rw)
NetC140_1: C140.1 U10.21(VCLAMPL)
NetC143_1: C143.1 U10.15(BSLN)
NetC143_2: C143.2 L20.1 U10.13(LOUTN) U10.14(LOUTN)
NetC144_1: C144.1 L19.2 U10.17(LOUTP) U10.18(LOUTP)
NetC144_2: C144.2 U10.16(BSLP)
NetC147_1: C147.1 L19.1 T8.1(Pri+)
NetC148_2: C148.2 L20.2 T8.2(Pri-)
NetLS5_1: LS5.1 T7.3(Sec+)
NetLS5_2: LS5.2 T7.4(Sec-)
NetLS6_1: LS6.1 T8.3(Sec+)
NetLS6_2: LS6.2 T8.4(Sec-)
NetR12_2: R12.2 U10.29(/SD)
NetR14_1: R14.1 U10.23(ROSC)

### Library data of the parts
C31 C98-C113 C137-C148 = Cap: Capacitor; Value: 0.1uF; Published: 8-Jun-2000; LatestRevisionDate: 17-Jul-2002; LatestRevisionNote: Re-released for DXP Platform.; PackageReference: RAD-0.3; Publisher: Altium Limited; PackageDescription: Radial Cap, Thru-Hole; 2 Leads; 0.3 in Pin Spacing
D9 D10 = Diode 1N4148: High Conductance Fast Diode; Published: 8-Jun-2000; LatestRevisionDate: 17-Jul-2002; LatestRevisionNote: Re-released for DXP Platform.; DatasheetVersion: 1997; PackageReference: DO-35; Publisher: Altium Limited; PackageDescription: Diode, Axial; Body 3.8 x 1.9 mm (LxDia. max), Lead Dia. 0.53 mm (max); Code_JEDEC: DO-204-AH; ComponentLink1Description: Manufacturer Link; ComponentLink1URL: http://www.fairchildsemi.com/; ComponentLink2Description: Datasheet; ComponentLink2URL: http://www.fairchildsemi.com/ds/1N%2F1N4148.pdf
L17-L20 = Inductor: Code_IEC: 1005; Published: 8-Jun-2000; LatestRevisionDate: 29-May-2009; LatestRevisionNote: IPC-7351 Footprint Added.; PackageReference: 0402-A; Publisher: Altium Limited; PackageDescription: Chip Inductor; Code_JEITA: 0402
LS5 LS6 = Speaker: Loudspeaker; Published: 24-Mar-1999; LatestRevisionDate: 17-Jul-2002; LatestRevisionNote: Re-released for DXP Platform.; PackageReference: PIN2; Publisher: Altium Limited
R12 = Res2: Resistor; Published: 8-Jun-2000; LatestRevisionDate: 17-Jul-2002; LatestRevisionNote: Re-released for DXP Platform.; PackageReference: AXIAL-0.4; Publisher: Altium Limited; PackageDescription: Axial Device, Thru-Hole; 2 Leads; 0.4 in Pin Spacing; Value: 10K
R14 = Res2: Resistor; Value: 10K; Published: 8-Jun-2000; LatestRevisionDate: 17-Jul-2002; LatestRevisionNote: Re-released for DXP Platform.; PackageReference: AXIAL-0.4; Publisher: Altium Limited; PackageDescription: Axial Device, Thru-Hole; 2 Leads; 0.4 in Pin Spacing
T7 T8 = Trans Eq: Transformer (Equivalent Circuit Model); Published: 8-Jun-2000; LatestRevisionDate: 17-Jul-2002; LatestRevisionNote: Re-released for DXP Platform.; PackageReference: TRF_4; Publisher: Altium Limited; PackageDescription: Transformer; 4 Leads

## Nets that join several sheets
3.3V: LLY (8 pins), POWER (C165.2 R22.2 U22.5), channel78 (R33.1 R34.1)
5V: POWER (6 pins), Audio_in (6 pins), Audio_out (U2.8), channel12 (U16.8 U17.8), channel78 (U24.8 U25.8), channel34 (U6.8 U9.8), channel56 (U11.8 U12.8)
12V: POWER (C161.1 J1.2 U21.3), Audio_out (D3.1 D4.1), channel12 (D5.1 D6.1), channel78 (8 pins), channel34 (D7.1 D8.1), channel56 (D9.1 D10.1)
DGND: LLY (19 pins), POWER (11 pins), Audio_in (16 pins), Audio_out (34 pins), channel12 (36 pins), channel78 (31 pins), channel34 (36 pins), channel56 (36 pins)
INC: LLY (U7.42), Audio_out (U2.1), channel12 (U16.1 U17.1), channel78 (U24.1 U25.1), channel34 (U6.1 U9.1), channel56 (U11.1 U12.1)
LEFT1: Audio_in (R2.1 U4.1), channel34 (C41.2 C77.2)
LEFT2: Audio_in (R9.1 U4.7), channel56 (C107.2 C113.2)
PB7: LLY (U7.43), Audio_out (U2.2), channel12 (U16.2 U17.2), channel78 (U24.2 U25.2), channel34 (U6.2 U9.2), channel56 (U11.2 U12.2)
PB14: LLY (U7.27), Audio_out (U2.7)
RIGHT1: Audio_in (R19.1 U13.1), Audio_out (C71.2), channel78 (C68.2 C70#2.1)
RIGHT2: Audio_in (R29.1 U13.7), channel12 (C69.2 C70#1.2)
Y0: LLY (U18.15), channel78 (U24.7)
Y1: LLY (U18.14), channel78 (U25.7)
Y2: LLY (U18.13), channel12 (U16.7)
Y3: LLY (U18.12), channel12 (U17.7)
Y4: LLY (U18.11), channel34 (U6.7)
Y5: LLY (U18.10), channel34 (U9.7)
Y6: LLY (U18.9), channel56 (U11.7)
Y7: LLY (U18.7), channel56 (U12.7)